# EAGLE schematic Assignment1BMM-Schematic-Ayah copy (EAGLE 9.6.2)
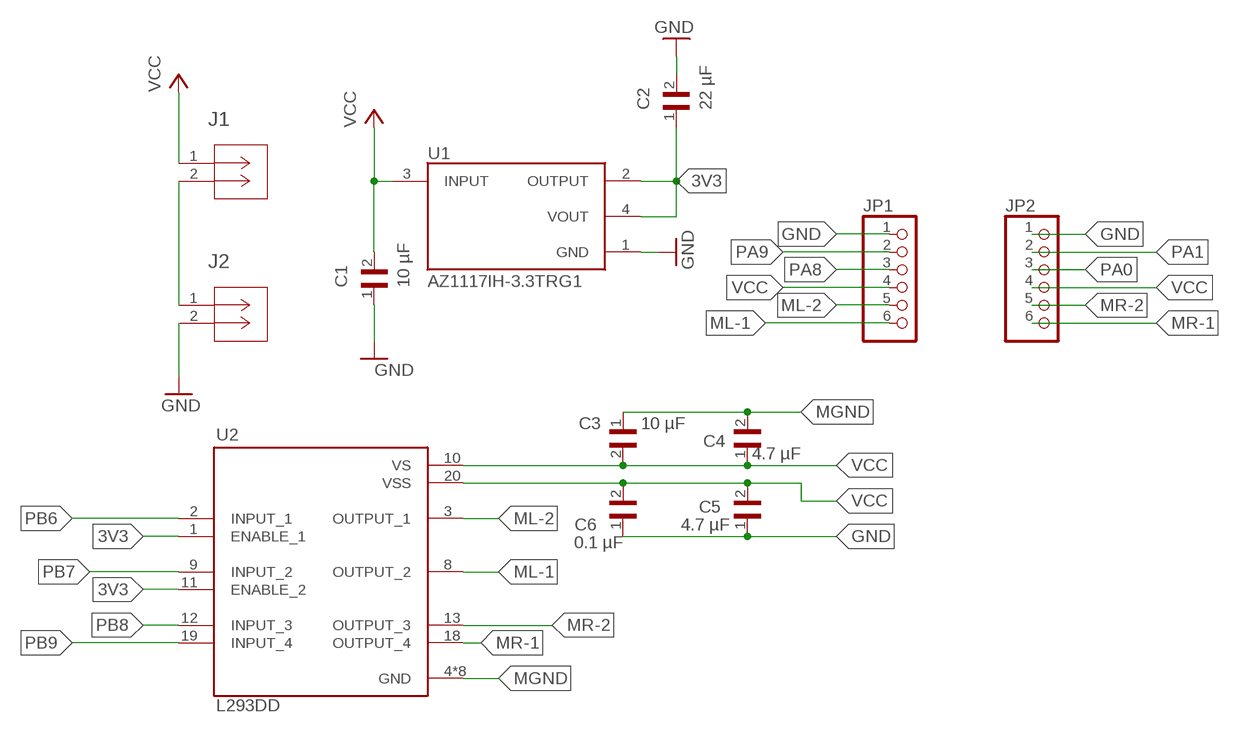
[diagram p0: schematic, sheet 1]

## Parts
C1  10 µF  GRM21BR61C106KE15L  [CAPC2012X135N]
C2  22 µF  GRM21BR61C226ME44L  [CAPC2012X145N]
C3  10 µF  GRM21BR61C106KE15L  [CAPC2012X135N]
C4  4.7 µF  GRM21BR71C475KE51L  [CAPC2012X140N]
C5  4.7 µF  GRM21BR71C475KE51L  [CAPC2012X140N]
C6  0.1 µF  GCM21BR72A104KA37K  [CAPC2012X140N]
J1  B2B-PH-K-S  [CONN2_B2B-PH-K-S_JST]
J2  B2B-PH-K-S  [CONN2_B2B-PH-K-S_JST]
JP1  PINHD-1X6  [1X06]
JP2  PINHD-1X6  [1X06]
U1  AZ1117IH-3.3TRG1  [SOT230P700X185-4N]
U2  L293DD  [SOIC127P1032X265-20N]

## Nets
3V3: C2.1 U1.2(OUTPUT) U1.4(VOUT) U2.1(ENABLE_1) U2.11(ENABLE_2)
GND: C1.1 C2.2 C5.1 C6.1 J2.2 JP1.1 JP2.1 U1.1(GND)
MGND: C3.1 C4.2 U2.4(GND) U2.5(GND) U2.6(GND) U2.7(GND) U2.14(GND) U2.15(GND) U2.16(GND) U2.17(GND)
ML-1: JP1.6 U2.8(OUTPUT_2)
ML-2: JP1.5 U2.3(OUTPUT_1)
MR-1: JP2.6 U2.18(OUTPUT_4)
MR-2: JP2.5 U2.13(OUTPUT_3)
N$1: J1.2 J2.1
PA0: JP2.3
PA1: JP2.2
PA8: JP1.3
PA9: JP1.2
PB6: U2.2(INPUT_1)
PB7: U2.9(INPUT_2)
PB8: U2.12(INPUT_3)
PB9: U2.19(INPUT_4)
VCC: C1.2 C3.2 C4.1 C5.2 C6.2 J1.1 JP1.4 JP2.4 U1.3(INPUT) U2.10(VS) U2.20(VSS)

## Library data of the parts
C1 C3 = GRM21BR61C106KE15L:GRM21BR61C106KE15L; CHECK_PRICES: https://www.snapeda.com/parts/GRM21BR61C106KE15L/Murata+Electronics+North+America/view-part/?ref=eda; DESCRIPTION: 10 µF ±10% 16V Ceramic Capacitor X5R 0805 (2012 Metric); MF: Murata; MP: GRM21BR61C106KE15L; PACKAGE: 2012 Murata; PURCHASE-URL: https://www.snapeda.com/api/url_track_click_mouser/?unipart_id=78773&manufacturer=Murata&part_name=GRM21BR61C106KE15L&search_term=None; SNAPEDA_LINK: https://www.snapeda.com/parts/GRM21BR61C106KE15L/Murata+Electronics+North+America/view-part/?ref=snap
C2 = GRM21BR61C226ME44L:GRM21BR61C226ME44L; CHECK_PRICES: https://www.snapeda.com/parts/GRM21BR61C226ME44L/Murata+Electronics+North+America/view-part/?ref=eda; DESCRIPTION: 22 µF ±20% 16V Ceramic Capacitor X5R 0805 (2012 Metric); MF: Murata; MP: GRM21BR61C226ME44L; PACKAGE: 2012 Murata; PURCHASE-URL: https://www.snapeda.com/api/url_track_click_mouser/?unipart_id=1755529&manufacturer=Murata&part_name=GRM21BR61C226ME44L&search_term=None; SNAPEDA_LINK: https://www.snapeda.com/parts/GRM21BR61C226ME44L/Murata+Electronics+North+America/view-part/?ref=snap
C4 C5 = GRM21BR71C475KE51L:GRM21BR71C475KE51L: SMD Capacitor X7R(EIA) with Capacitance: 4.7uF Tol. 10%. Rated Voltage: 16Vdc; CHECK_PRICES: https://www.snapeda.com/parts/GRM21BR71C475KE51L/Murata/view-part/?ref=eda; DESCRIPTION: 4.7 µF ±10% 16V Ceramic Capacitor X7R 0805 (2012 Metric); DIGIKEY_PART_NUMBER: 490-14466-2-ND; MF: Murata Electronics; MP: GRM21BR71C475KE51L; PACKAGE: 0805 Murata Electronics; PURCHASE-URL: https://www.snapeda.com/api/url_track_click_mouser/?unipart_id=5514957&manufacturer=Murata Electronics&part_name=GRM21BR71C475KE51L&search_term=None; SNAPEDA_LINK: https://www.snapeda.com/parts/GRM21BR71C475KE51L/Murata/view-part/?ref=snap
C6 = GCM21BR72A104KA37K:GCM21BR72A104KA37K; CHECK_PRICES: https://www.snapeda.com/parts/GCM21BR72A104KA37K/Murata+Electronics+North+America/view-part/?ref=eda; DESCRIPTION: 0.1 µF ±10% 100V Ceramic Capacitor X7R 0805 (2012 Metric); MF: Murata; MP: GCM21BR72A104KA37K; PACKAGE: 2012 Murata; PURCHASE-URL: https://www.snapeda.com/api/url_track_click_mouser/?unipart_id=1756077&manufacturer=Murata&part_name=GCM21BR72A104KA37K&search_term=None; SNAPEDA_LINK: https://www.snapeda.com/parts/GCM21BR72A104KA37K/Murata+Electronics+North+America/view-part/?ref=snap
J1 J2 = 2 Pin JST Connector:B2B-PH-K-S; COPYRIGHT: Copyright (C) 2023 Ultra Librarian. All rights reserved.; DIGIKEY_PART_NUMBER_1: 455-1262-ND; MANUFACTURER_PART_NUMBER: B2B-PH-K-S; MFR_NAME: JST
JP1 JP2 = pinhead:PINHD-1X6: PIN HEADER
U1 = AZ1117IH-3.3TRG1:AZ1117IH-3.3TRG1: Check availability <https://pricing.snapeda.com/parts/AZ1117IH-3.3TRG1/Diodes%20Inc./view-part?ref=eda>; AVAILABILITY: In Stock; CHECK_PRICES: https://www.snapeda.com/parts/AZ1117IH-3.3TRG1/Diodes+Inc./view-part/?ref=eda; DESCRIPTION: Linear Voltage Regulator IC Positive Fixed 1 Output 1A SOT-223-3; MF: Diodes Inc.; MP: AZ1117IH-3.3TRG1; PACKAGE: SOT-223 Diodes Inc.; PRICE: None; PURCHASE-URL: https://www.snapeda.com/api/url_track_click_mouser/?unipart_id=490259&manufacturer=Diodes Inc.&part_name=AZ1117IH-3.3TRG1&search_term=az1117ih-3.3trg1; SNAPEDA_LINK: https://www.snapeda.com/parts/AZ1117IH-3.3TRG1/Diodes+Inc./view-part/?ref=snap
U2 = L293DD:L293DD: L293DD Series Push - Pull Quad Channel Driver with Diodes - SOIC-20; CHECK_PRICES: https://www.snapeda.com/parts/L293DD/STMicroelectronics/view-part/?ref=eda; DESCRIPTION: Bipolar Motor Driver Parallel 20-SOIC; DIGIKEY_PART_NUMBER: 497-1390-5-ND; MF: STMicroelectronics; MP: L293DD; PACKAGE: SOIC-20 STMicroelectronics; PURCHASE-URL: https://www.snapeda.com/api/url_track_click_mouser/?unipart_id=48952&manufacturer=STMicroelectronics&part_name=L293DD&search_term=None; SNAPEDA_LINK: https://www.snapeda.com/parts/L293DD/STMicroelectronics/view-part/?ref=snap